# EasyEDA Pro project OctoSlime_Haptics_Module.eprj

# Schematic Haptics
Create Date: 2022-07-25; Page Name: P1; Project Name: OctoSlime_Haptics_Module; Schematic Name: Haptics; Update Date: 2022-08-20; Drawed: KeonMan; Part Number: EmbeddedAT_Hap01; Reviewed: KeonMan; Version: 1.0
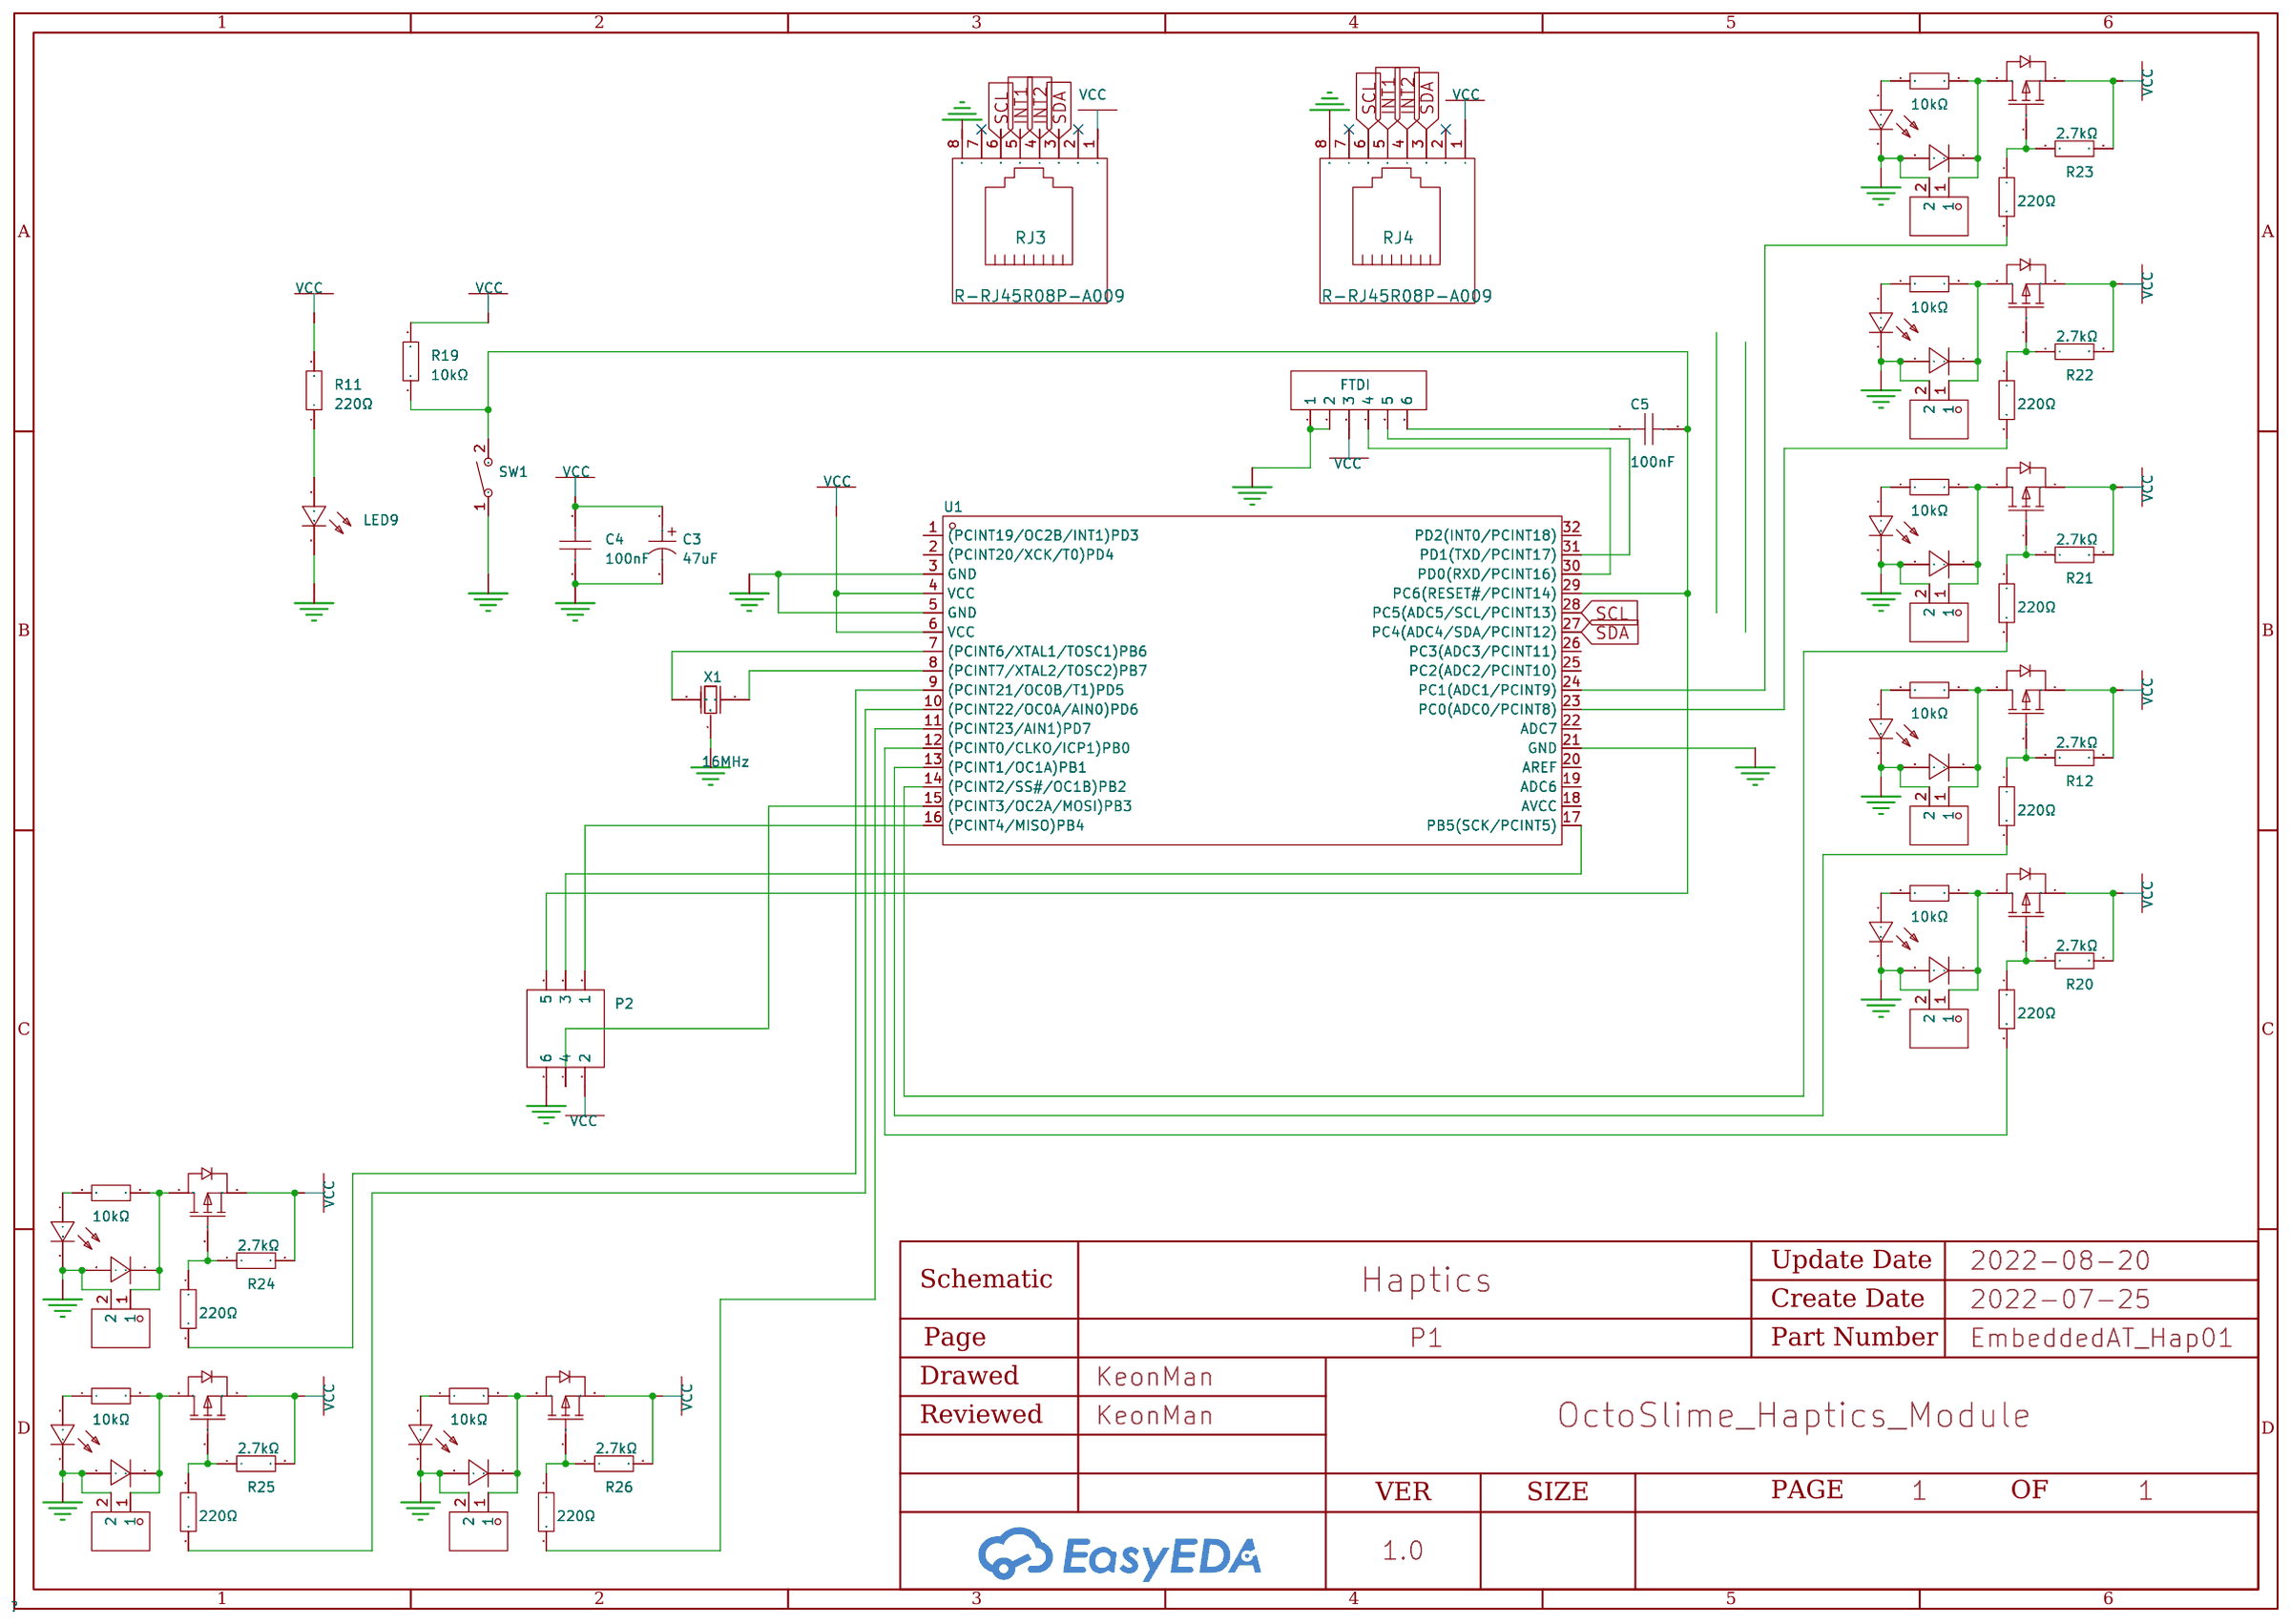
[diagram p0: schematic sheet]

## Parts
C3  47uF  [CAP-SMD_L7.3-W4.3-FD]
C4  100nF  [C0603]
C5  100nF  [C0603]
CN1  -  [CONN-TH_2P-P2.50_HX25003-2WAP]
CN2  -  [CONN-TH_2P-P2.50_HX25003-2WAP]
CN3  -  [CONN-TH_2P-P2.50_HX25003-2WAP]
CN4  -  [CONN-TH_2P-P2.50_HX25003-2WAP]
CN5  -  [CONN-TH_2P-P2.50_HX25003-2WAP]
CN6  -  [CONN-TH_2P-P2.50_HX25003-2WAP]
CN7  -  [CONN-TH_2P-P2.50_HX25003-2WAP]
CN8  -  [CONN-TH_2P-P2.50_HX25003-2WAP]
D1  -  [DO-214AC_L4.3-W2.7-LS5.3-RD]
D2  -  [DO-214AC_L4.3-W2.7-LS5.3-RD]
D3  -  [DO-214AC_L4.3-W2.7-LS5.3-RD]
D4  -  [DO-214AC_L4.3-W2.7-LS5.3-RD]
D5  -  [DO-214AC_L4.3-W2.7-LS5.3-RD]
D6  -  [DO-214AC_L4.3-W2.7-LS5.3-RD]
D7  -  [DO-214AC_L4.3-W2.7-LS5.3-RD]
D8  -  [DO-214AC_L4.3-W2.7-LS5.3-RD]
FTDI  -  [HDR-TH_6P-P2.54-V-M-1]
LED1  -  [LED0603-R-RD]
LED2  -  [LED0603-R-RD]
LED3  -  [LED0603-R-RD]
LED4  -  [LED0603-R-RD]
LED5  -  [LED0603-R-RD]
LED6  -  [LED0603-R-RD]
LED7  -  [LED0603-R-RD]
LED8  -  [LED0603-R-RD]
LED9  -  [LED0603-R-RD]
P2  -  [IDC-TH_6P-P2.54_C11214]
Q1  -  [SC-70-3_L2.2-W1.2-P1.30-LS2.1-BL]
Q2  -  [SC-70-3_L2.2-W1.2-P1.30-LS2.1-BL]
Q3  -  [SC-70-3_L2.2-W1.2-P1.30-LS2.1-BL]
Q4  -  [SC-70-3_L2.2-W1.2-P1.30-LS2.1-BL]
Q5  -  [SC-70-3_L2.2-W1.2-P1.30-LS2.1-BL]
Q6  -  [SC-70-3_L2.2-W1.2-P1.30-LS2.1-BL]
Q7  -  [SC-70-3_L2.2-W1.2-P1.30-LS2.1-BL]
Q8  -  [SC-70-3_L2.2-W1.2-P1.30-LS2.1-BL]
R1  220Ω  [R1206]
R2  220Ω  [R1206]
R3  10kΩ  [R0603]
R4  220Ω  [R1206]
R5  10kΩ  [R0603]
R6  220Ω  [R1206]
R7  10kΩ  [R0603]
R8  220Ω  [R1206]
R9  10kΩ  [R0603]
R10  220Ω  [R1206]
R11  220Ω  [R1206]
R12  2.7kΩ  [R0603]
R13  10kΩ  [R0603]
R14  10kΩ  [R0603]
R15  220Ω  [R1206]
R16  10kΩ  [R0603]
R17  220Ω  [R1206]
R18  10kΩ  [R0603]
R19  10kΩ  [R0603]
R20  2.7kΩ  [R0603]
R21  2.7kΩ  [R0603]
R22  2.7kΩ  [R0603]
R23  2.7kΩ  [R0603]
R24  2.7kΩ  [R0603]
R25  2.7kΩ  [R0603]
R26  2.7kΩ  [R0603]
RJ3  R-RJ45R08P-A009  [RJ45-TH_R-RJ45R08P-A009]
RJ4  R-RJ45R08P-A009  [RJ45-TH_R-RJ45R08P-A009]
SW1  -  [SW-SMD_L4.0-W2.9-LS5.0]
U1  -  [TQFP-32_L7.0-W7.0-P0.80-LS9.0-BL]
X1  16MHz  [OSC-SMD_3P-L3.2-W1.3-P1.2-L]

## Library data of the parts
C3 = CA45-D-25V-47μF-K: 容值:47uF;精度:±10%;额定电压:25V;等效串联电阻:900mΩ@100kHz;工作温度:-55~+125;; LCSC Part Name: 47uF ±10% 25V; Supplier Part: C503929; Manufacturer: TORCH(火炬); Manufacturer Part: CA45-D-25V-47F-K; Supplier Footprint: CASE-D_7343; JLCPCB Part Class: Extended Part; Datasheet: https://atta.szlcsc.com/upload/public/pdf/source/20200527/C503929_DDEB89F05F49DCBD18C8D5A9FE4E26C7.pdf; Supplier: LCSC; Tolerance: ±10%; Rated Voltage: 25V; Equivalent Series Resistance(ESR): 900mΩ@100kHz; Operating Temperature: -55~+125
C4 C5 = CL10B104KB8NNNC: 容值:100nF;精度:±10%;额定电压:50V;温度系数:X7R;; LCSC Part Name: 100nF ±10% 50V; Supplier Part: C1591; Manufacturer: SAMSUNG(三星); Supplier Footprint: 0603; JLCPCB Part Class: Extended Part; Datasheet: https://atta.szlcsc.com/upload/public/pdf/source/20160103/1457707680512.pdf; Supplier: LCSC; Tolerance: ±10%; Voltage Rated: 50V; Temperature Coefficient: X7R
CN1-CN8 = HX25003-2WAP: 俗称： XH2.54 配套：HX25002-2Y; LCSC Part Name: 母座 弯插/弯针 2.5mm 2Pin位; Supplier Part: C442326; Manufacturer: HX(红星); Supplier Footprint: 插件,P=2.5mm; JLCPCB Part Class: Extended Part; Datasheet: https://atta.szlcsc.com/upload/public/pdf/source/20191028/C442326_951D1FF48F4BC139C99E649B2A876D28.pdf; Supplier: LCSC
D1-D8 = M7_C95872: 二极管配置:-;直流反向耐压(Vr):1kV;平均整流电流(Io):1A;正向压降(Vf):1.1V@1A;反向电流(Ir):5A@1kV;; LCSC Part Name: 1kV 1A 1.1V@1A GPP; Supplier Part: C95872; Manufacturer: MDD; Manufacturer Part: M7; Supplier Footprint: SMA(DO-214AC); JLCPCB Part Class: Basic Part; Datasheet: https://atta.szlcsc.com/upload/public/pdf/source/20170221/1487670316366.pdf; Supplier: LCSC; Reverse Voltage (Vr): 1kV; Average Rectified Current (Io): 1A; Forward Voltage (Vf@If): 1.1V@1A; Reverse Leakage Current: 5A@1kV
FTDI = 2.54-1x6P直针: 间距:2.54mm;总PIN位数:6;排数:1;插针结构:-;行距:-;安装类型:直插;圆针/方针:-;额定电流:-;额定电压:-;配合针长度:-;塑高:-;触头材质:黄铜;触头镀层:-;颜色:黑色;; LCSC Part Name: 2.54mm; Supplier Part: C37208; Manufacturer: BOOMELE(博穆精密); Supplier Footprint: 插件,P=2.54mm; JLCPCB Part Class: Extended Part; Datasheet: https://atta.szlcsc.com/upload/public/pdf/source/20151109/1457707558014.pdf; Supplier: LCSC; Pitch: 2.54mm; Number of Pins: 6; Number of Rows: 1; Mounting Type: 直插; Contact Material: 黄铜; Color: 黑色
LED1-LED9 = 19-213/R6C-AP1Q2B/3T: 发光颜色:红灯;; LCSC Part Name: Briliant Red; Supplier Part: C128051; Manufacturer: EVERLIGHT(台湾亿光); Supplier Footprint: 0603; JLCPCB Part Class: Extended Part; Datasheet: https://atta.szlcsc.com/upload/public/pdf/source/20181127/C128051_25A9A75D91D4088C5FF567B51E5BBE72.pdf; Supplier: LCSC; Emitted Color: 红灯
P2 = 2.54-2*3P简牛: 连接器类型:简牛座;间距:2.54mm;排数:2;行距:2.54mm;封装形式:直插;触头材质:黄铜;触头镀层:金;; LCSC Part Name: 2.54mm 排数:2 2*3P; Supplier Part: C11214; Manufacturer: BOOMELE(博穆精密); Supplier Footprint: 插件,P=2.54mm; JLCPCB Part Class: Extended Part; Datasheet: https://atta.szlcsc.com/upload/public/pdf/source/20140331/1457707037652.pdf; Supplier: LCSC; Connector Type: 简牛座; Pitch: 2.54mm; Number of Rows: 2; Row Spacing: 2.54mm; Holder Type: 直插; Contact Material: 黄铜; Contact Plating: 金
Q1-Q8 = CJ2101: 类型:P沟道;漏源电压(Vdss):20V;连续漏极电流(Id):1.4A;功率(Pd):290mW;导通电阻(RDS(on)@Vgs,Id):100mΩ@4.5V,1A;阈值电压(Vgs(th)@Id):700mV@250A;; LCSC Part Name: P沟道 20V 1.4A; Supplier Part: C52641; Manufacturer: CJ（江苏长电/长晶）; Supplier Footprint: SOT-323(SC-70); JLCPCB Part Class: Extended Part; Datasheet: https://atta.szlcsc.com/upload/public/pdf/source/20160713/1468379852203.pdf; Supplier: LCSC; Type: P沟道; Drain Source Voltage (Vdss): 20V; Continuous Drain Current (Id): 1.4A; Power Dissipation (Pd): 290mW; Drain Source On Resistance (RDS(on)@Vgs,Id): 100mΩ@4.5V,1A; Gate Threshold Voltage (Vgs(th)@Id): 700mV@250A
R1 R2 R4 R6 R8 R10 R11 R15 R17 = RC1206FR-07220RL: 电阻类型:厚膜电阻;阻值:220Ω;精度:±1%;功率:250mW;温度系数:±100ppm/;最大工作电压:200V;工作温度范围:-55~+155;; LCSC Part Name: 220Ω ±1%; Supplier Part: C137353; Manufacturer: YAGEO(国巨); Supplier Footprint: 1206; JLCPCB Part Class: Extended Part; Datasheet: https://atta.szlcsc.com/upload/public/pdf/source/20171106/C137353_15099603814611093519.pdf; Supplier: LCSC; Type: 厚膜电阻; Tolerance: ±1%; Power(Watts): 250mW; Temperature Coefficient: ±100ppm/; Overload Voltage (Max): 200V; Operating Temperature Range: -55~+155
R3 R5 R7 R9 R13 R14 R16 R18 R19 = AR03BTDX1002: 电阻类型:薄膜电阻;阻值:10kΩ;精度:±0.1%;功率:100mW;温度系数:±50ppm/;最大工作电压:50V;工作温度范围:-55~+155;; LCSC Part Name: 10kΩ ±0.1% 100mW; Supplier Part: C319938; Manufacturer: 光颉(Viking); Supplier Footprint: 0603; JLCPCB Part Class: Extended Part; Datasheet: https://atta.szlcsc.com/upload/public/pdf/source/20181130/C319938_77E38B8D4CD7481495A6FE69BA8AB438.pdf; Supplier: LCSC; Type: 薄膜电阻; Tolerance: ±0.1%; Power(Watts): 100mW; Temperature Coefficient: ±50ppm/; Overload Voltage (Max): 50V; Operating Temperature Range: -55~+155
R12 R20-R26 = 0603WAF2701T5E: 电阻类型:厚膜电阻;阻值:2.7kΩ;精度:±1%;功率:100mW;温度系数:±100ppm/;最大工作电压:75V;工作温度范围:-55~+155;; LCSC Part Name: 2.7kΩ ±1% 100mW; Supplier Part: C13167; Manufacturer: UNI-ROYAL(厚声); Supplier Footprint: 0603; JLCPCB Part Class: Basic Part; Datasheet: https://atta.szlcsc.com/upload/public/pdf/source/20200306/C422600_1E6D84923E4A46A82E41ADD87F860B5C.pdf; Supplier: LCSC; Type: 厚膜电阻; Tolerance: ±1%; Power(Watts): 100mW; Temperature Coefficient: ±100ppm/; Overload Voltage (Max): 75V; Operating Temperature Range: -55~+155
RJ3 RJ4 = R-RJ45R08P-A009: link: https://atta.szlcsc.com/upload/public/pdf/source/20211021/D54662BD8381AD1D1DF920996089EE18.pdf; Supplier: LCSC; Supplier Part: C2902700; Manufacturer: Ckmtw(灿科盟); JLCPCB Part Class: Extended Part
SW1 = TS342A2P-WZ: LCSC Part Name: 轻触开关 3*4*2 两脚小龟不带柱 250gf 黑色塑胶按钮; Supplier Part: C557591; Manufacturer: SHOU HAN(首韩); Supplier Footprint: SMD; JLCPCB Part Class: Extended Part; Datasheet: https://atta.szlcsc.com/upload/public/pdf/source/20200519/C557591_B3A5A21584733303F06306F18577DA8B.pdf; Supplier: LCSC
U1 = ATMEGA328P-AU: CPU内核:AVR;主频（MAX):20MHz;工作电压:1.8V ~ 5.5V;; Supplier Part: C14877; Manufacturer: MICROCHIP(美国微芯); Supplier Footprint: TQFP-32_7x7x08P; JLCPCB Part Class: Basic Part; Datasheet: https://atta.szlcsc.com/upload/public/pdf/source/20140621/1457707095197.pdf; Supplier: LCSC; Core Processor: AVR; Speed: 20MHz; Voltage - Supply (Vcc/Vdd): 1.8V ~ 5.5V; Program Memory Size: 32KB (16W); RAM Size: 2KB; EEPROM Size: 1KB; Number of I/O: 23; A/D: 8x10bit; PWM: 6
X1 = CSTNE16M0V530000R0: 频率:16MHz;频率容差:±0.5%;内藏负载电容:15pF;谐振阻抗:40Ω;; LCSC Part Name: 16MHz ±0.5% 15pF; Supplier Part: C341521; Manufacturer: muRata(村田); Supplier Footprint: SMD3213-3P; JLCPCB Part Class: Extended Part; Datasheet: https://atta.szlcsc.com/upload/public/pdf/source/20181211/C341521_3DF77211002AAEDE8E1FD920A512C1E4.pdf; Supplier: LCSC; Frequency Stability: ±0.3%; Frequency Tolerance: ±0.5%; Built-in Load Capacitance: 15pF; Resonant Impedance: 40Ω; Operating Temperature: -40~+85

## Nets
GND: C3.2 C4.1 CN1.2 CN2.2 CN3.2 CN4.2 CN5.2 CN6.2 CN7.2 CN8.2 D1.2(A) D2.2(A) D3.2(A) D4.2(A) D5.2(A) D6.2(A) D7.2(A) D8.2(A) FTDI.1 FTDI.2 LED1.2(C) LED2.2(C) LED3.2(C) LED4.2(C) LED5.2(C) LED6.2(C) LED7.2(C) LED8.2(C) LED9.2(C) P2.6 RJ3.8 RJ4.8 SW1.1 U1.3(GND) U1.5(GND) U1.21(GND) X1.2(GND)
VCC: C3.1 C4.2 FTDI.3 P2.2 Q1.2(S) Q2.2(S) Q3.2(S) Q4.2(S) Q5.2(S) Q6.2(S) Q7.2(S) Q8.2(S) R11.2 R12.2 R19.2 R20.2 R21.2 R22.2 R23.2 R24.2 R25.2 R26.2 RJ3.1 RJ4.1 U1.4(VCC) U1.6(VCC)
INT1: RJ3.5 RJ4.5
INT2: RJ3.4 RJ4.4
SCL: RJ3.6 RJ4.6 U1.28(PC5(ADC5/SCL/PCINT13))
SDA: RJ3.3 RJ4.3 U1.27(PC4(ADC4/SDA/PCINT12))
$1N5111: U1.7((PCINT6/XTAL1/TOSC1)PB6) X1.3(OSC2)
$1N5116: U1.8((PCINT7/XTAL2/TOSC2)PB7) X1.1(OSC1)
$1N6625: R17.2 U1.9((PCINT21/OC0B/T1)PD5)
$1N10865: P2.1 U1.16((PCINT4/MISO)PB4)
$1N10972: P2.3 U1.17(PB5(SCK/PCINT5))
$1N11114: C5.2 P2.5 R19.1 SW1.2 U1.29(PC6(RESET#/PCINT14))
$1N11268: P2.4 U1.15((PCINT3/OC2A/MOSI)PB3)
$1N21722: LED9.1(A) R11.1
$1N25142: R1.2 U1.24(PC1(ADC1/PCINT9))
$1N25143: R2.2 U1.23(PC0(ADC0/PCINT8))
$1N25144: R4.2 U1.14((PCINT2/SS#/OC1B)PB2)
$1N25145: R6.2 U1.13((PCINT1/OC1A)PB1)
$1N25146: R8.2 U1.12((PCINT0/CLKO/ICP1)PB0)
$1N25147: R10.2 U1.11((PCINT23/AIN1)PD7)
$1N25149: R15.2 U1.10((PCINT22/OC0A/AIN0)PD6)
$1N42067: Q5.1(G) R8.1 R20.1
$1N47436: C5.1 FTDI.6
$1N47489: FTDI.5 U1.31(PD1(TXD/PCINT17))
$1N47548: FTDI.4 U1.30(PD0(RXD/PCINT16))
$1N67957: LED5.1(A) R9.1
$1N70049: CN5.1 D4.1(K) Q5.3(D) R9.2
$1N76307: CN4.1 D3.1(K) Q4.3(D) R7.2
$1N76308: LED4.1(A) R7.1
$1N76310: Q4.1(G) R6.1 R12.1
$1N77326: CN3.1 D2.1(K) Q3.3(D) R5.2
$1N77327: LED3.1(A) R5.1
$1N77329: Q3.1(G) R4.1 R21.1
$1N78229: CN2.1 D1.1(K) Q2.3(D) R3.2
$1N78230: LED2.1(A) R3.1
$1N78232: Q2.1(G) R2.1 R22.1
$1N79139: CN1.1 D8.1(K) Q1.3(D) R13.2
$1N79140: LED1.1(A) R13.1
$1N79142: Q1.1(G) R1.1 R23.1
$1N80056: CN8.1 D7.1(K) Q8.3(D) R18.2
$1N80057: LED8.1(A) R18.1
$1N80059: Q8.1(G) R17.1 R24.1
$1N81090: CN7.1 D6.1(K) Q7.3(D) R16.2
$1N81091: LED7.1(A) R16.1
$1N81093: Q7.1(G) R15.1 R25.1
$1N82688: CN6.1 D5.1(K) Q6.3(D) R14.2
$1N82689: LED6.1(A) R14.1
$1N82691: Q6.1(G) R10.1 R26.1

Not connected (* = marked no-connect by the designer): RJ3 2* 7*; RJ4 2* 7*; U1 1((PCINT19/OC2B/INT1)PD3) 2((PCINT20/XCK/T0)PD4) 18(AVCC) 19(ADC6) 20(AREF) 22(ADC7) 25(PC2(ADC2/PCINT10)) 26(PC3(ADC3/PCINT11)) 32(PD2(INT0/PCINT18))

# Board PCB1
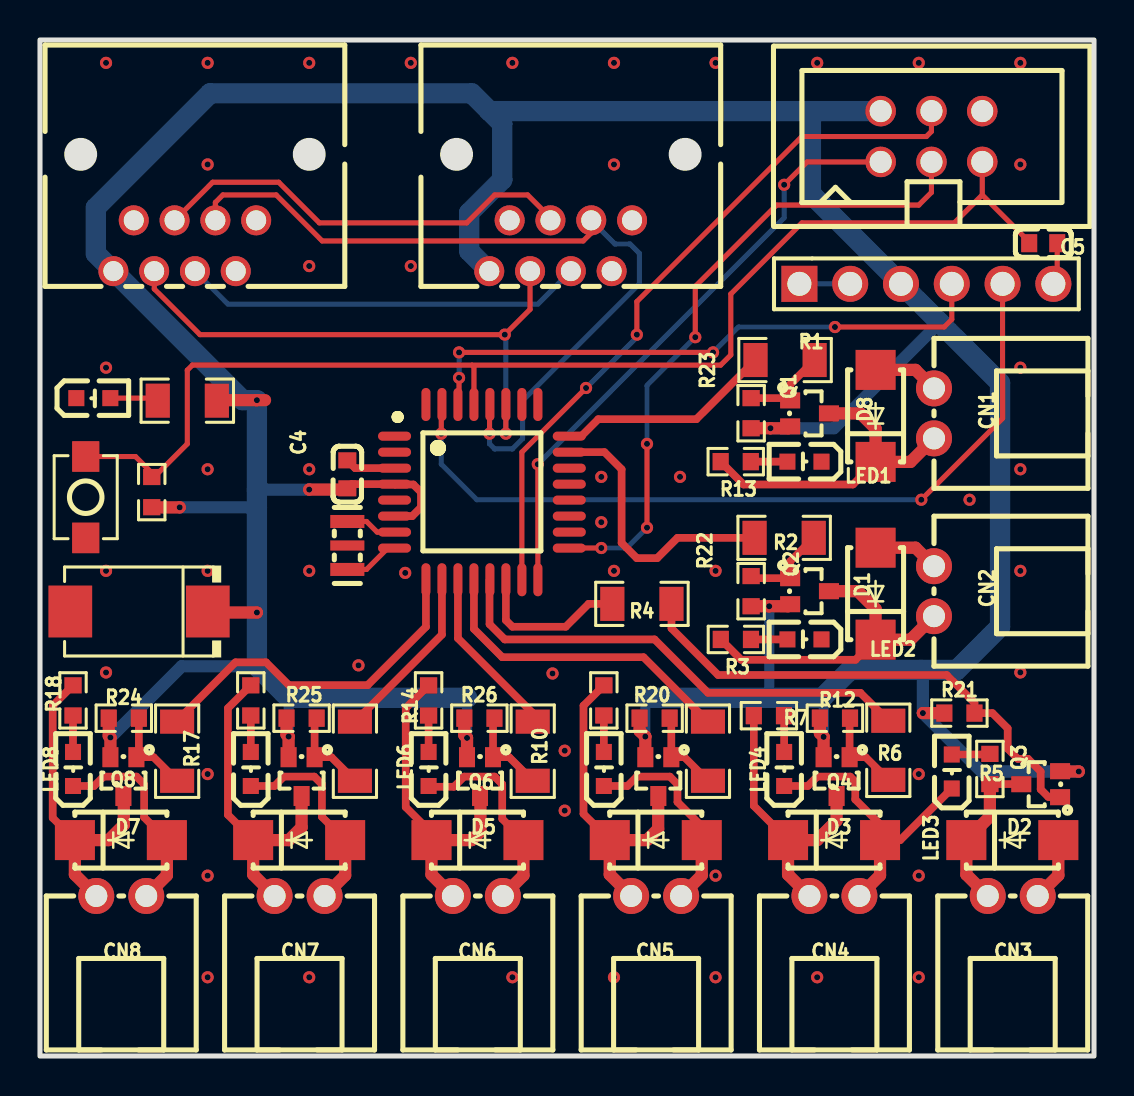
[diagram p1: board, top side]
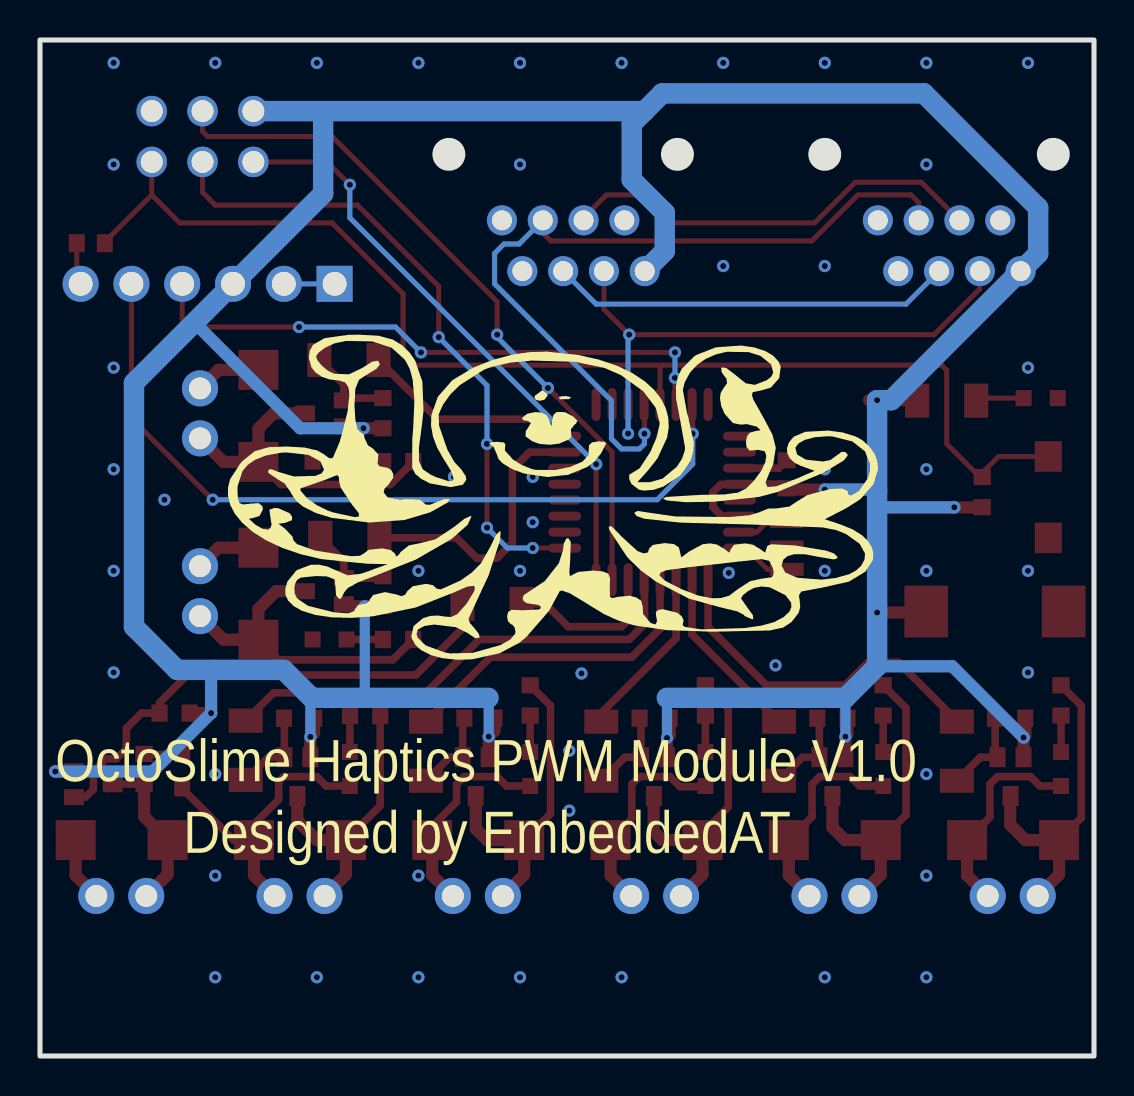
[diagram p2: board, bottom side, seen from below]

Outline 52.7 x 50.8 mm; copper layers: Top Layer, Bottom Layer. Coordinates in mm from the lower left corner of the outline.
Outline path: rectangle 0,50.8 52.7,0
Stack: Top Layer 0.035mm / Dielectric1 1.51mm FR4 er 4.5 / Bottom Layer 0.035mm

## Design rules (mm)
spacing safeClearance (default): track to track 0.152, other pairs 0.152 to 0.3
track width trackWidth (default): min 0.127, default 0.254, max 2.54
differential pair differentialPair (default): width min 0.127, default 0.254, max 2.54; gap min 0.152, default 0.152
via viaSize (default): diameter min 0.5, default 0.61, max 10; hole min 0.3, default 0.305, max 6

## Placement (name value [footprint] x y rotation side)
C3  47uF  [CAP-SMD_L7.3-W4.3-FD]  4.95 22.23 180 top
C4  100nF  [C0603]  15.37 29.08 270 top
C5  100nF  [C0603]  50.17 40.64 180 top
CN1  -  [CONN-TH_2P-P2.50_HX25003-2WAP]  44.7 32.13 90 top
CN2  -  [CONN-TH_2P-P2.50_HX25003-2WAP]  44.7 23.24 90 top
CN3  -  [CONN-TH_2P-P2.50_HX25003-2WAP]  48.64 8 0 top
CN4  -  [CONN-TH_2P-P2.50_HX25003-2WAP]  39.73 8 0 top
CN5  -  [CONN-TH_2P-P2.50_HX25003-2WAP]  30.81 8 0 top
CN6  -  [CONN-TH_2P-P2.50_HX25003-2WAP]  21.89 8 0 top
CN7  -  [CONN-TH_2P-P2.50_HX25003-2WAP]  12.98 8 0 top
CN8  -  [CONN-TH_2P-P2.50_HX25003-2WAP]  4.06 8 0 top
D1  -  [DO-214AC_L4.3-W2.7-LS5.3-RD]  41.78 23.11 90 top
D2  -  [DO-214AC_L4.3-W2.7-LS5.3-RD]  48.62 10.8 0 top
D3  -  [DO-214AC_L4.3-W2.7-LS5.3-RD]  39.71 10.8 0 top
D4  -  [DO-214AC_L4.3-W2.7-LS5.3-RD]  30.79 10.8 0 top
D5  -  [DO-214AC_L4.3-W2.7-LS5.3-RD]  21.87 10.8 0 top
D6  -  [DO-214AC_L4.3-W2.7-LS5.3-RD]  12.96 10.8 0 top
D7  -  [DO-214AC_L4.3-W2.7-LS5.3-RD]  4.04 10.8 0 top
D8  -  [DO-214AC_L4.3-W2.7-LS5.3-RD]  41.78 32 90 top
FTDI  -  [HDR-TH_6P-P2.54-V-M-1]  44.32 38.61 0 top
LED1  -  [LED0603-R-RD]  38.23 29.72 180 top
LED2  -  [LED0603-R-RD]  38.23 20.83 180 top
LED3  -  [LED0603-R-RD]  45.59 14.22 90 top
LED4  -  [LED0603-R-RD]  37.21 14.35 90 top
LED5  -  [LED0603-R-RD]  28.19 14.35 90 top
LED6  -  [LED0603-R-RD]  19.43 14.35 90 top
LED7  -  [LED0603-R-RD]  10.54 14.35 90 top
LED8  -  [LED0603-R-RD]  1.65 14.35 90 top
LED9  -  [LED0603-R-RD]  2.67 32.89 0 top
P2  -  [IDC-TH_6P-P2.54_C11214]  44.58 45.97 0 top
Q1  -  [SC-70-3_L2.2-W1.2-P1.30-LS2.1-BL]  38.48 32.13 270 top
Q2  -  [SC-70-3_L2.2-W1.2-P1.30-LS2.1-BL]  38.48 23.24 270 top
Q3  -  [SC-70-3_L2.2-W1.2-P1.30-LS2.1-BL]  50.04 13.59 90 top
Q4  -  [SC-70-3_L2.2-W1.2-P1.30-LS2.1-BL]  39.83 13.97 180 top
Q5  -  [SC-70-3_L2.2-W1.2-P1.30-LS2.1-BL]  30.92 13.97 180 top
Q6  -  [SC-70-3_L2.2-W1.2-P1.30-LS2.1-BL]  22 13.97 180 top
Q7  -  [SC-70-3_L2.2-W1.2-P1.30-LS2.1-BL]  13.08 13.97 180 top
Q8  -  [SC-70-3_L2.2-W1.2-P1.30-LS2.1-BL]  4.17 13.97 180 top
R1  220Ω  [R1206]  37.26 34.8 180 top
R2  220Ω  [R1206]  37.21 25.91 180 top
R3  10kΩ  [R0603]  34.8 20.83 180 top
R4  220Ω  [R1206]  30.1 22.61 180 top
R5  10kΩ  [R0603]  47.5 14.35 270 top
R6  220Ω  [R1206]  42.42 15.29 90 top
R7  10kΩ  [R0603]  36.45 17.02 180 top
R8  220Ω  [R1206]  33.4 15.24 90 top
R9  10kΩ  [R0603]  28.19 17.78 90 top
R10  220Ω  [R1206]  24.64 15.24 90 top
R11  220Ω  [R1206]  7.37 32.77 0 top
R12  2.7kΩ  [R0603]  39.75 16.89 180 top
R13  10kΩ  [R0603]  34.79 29.72 180 top
R14  10kΩ  [R0603]  19.43 17.78 90 top
R15  220Ω  [R1206]  15.75 15.24 90 top
R16  10kΩ  [R0603]  10.54 17.78 90 top
R17  220Ω  [R1206]  6.86 15.24 90 top
R18  10kΩ  [R0603]  1.65 17.78 90 top
R19  10kΩ  [R0603]  5.59 28.19 270 top
R20  2.7kΩ  [R0603]  30.73 16.89 180 top
R21  2.7kΩ  [R0603]  45.97 17.14 180 top
R22  2.7kΩ  [R0603]  35.56 23.24 270 top
R23  2.7kΩ  [R0603]  35.56 32.14 270 top
R24  2.7kΩ  [R0603]  4.19 16.89 180 top
R25  2.7kΩ  [R0603]  13.08 16.89 180 top
R26  2.7kΩ  [R0603]  21.97 16.89 180 top
RJ3  R-RJ45R08P-A009  [RJ45-TH_R-RJ45R08P-A009]  26.04 40.51 180 top
RJ4  R-RJ45R08P-A009  [RJ45-TH_R-RJ45R08P-A009]  7.24 40.51 180 top
SW1  -  [SW-SMD_L4.0-W2.9-LS5.0]  2.29 27.94 90 top
U1  -  [TQFP-32_L7.0-W7.0-P0.80-LS9.0-BL]  22.1 28.19 270 top
X1  16MHz  [OSC-SMD_3P-L3.2-W1.3-P1.2-L]  15.37 25.53 90 top

## Footprints (pads in the part's own frame, mm; a bottom-side part is the same pattern mirrored in y, then rotated)
C0603
  rect 0.8x0.899 smd: 1(-0.701,0) 2(0.701,0)
CAP-SMD_L7.3-W4.3-FD
  rect 2.184x2.591 smd: 1(-3.437,0) 2(3.437,0)
CONN-TH_2P-P2.50_HX25003-2WAP
  round 1.801 hole 1.1: 1(-1.25,0) 2(1.25,0)
DO-214AC_L4.3-W2.7-LS5.3-RD
  rect 1.999x1.999 smd: 1(-2.299,0) 2(2.301,0)
HDR-TH_6P-P2.54-V-M-1
  rect 1.801x1.801 hole 1.199: 1(-6.35,0)
  round 1.801 hole 1.199: 2(-3.81,0) 3(-1.27,0) 4(1.27,0) 5(3.81,0) 6(6.35,0)
IDC-TH_6P-P2.54_C11214
  round 1.524 hole 1.1: 1(-2.54,-1.27) 2(-2.54,1.27) 3(0,-1.27) 4(0,1.27) 5(2.54,-1.27) 6(2.54,1.27)
LED0603-R-RD
  rect 0.8x0.8 smd: 1(0.851,0) 2(-0.851,0)
OSC-SMD_3P-L3.2-W1.3-P1.2-L
  rect 0.65x1.7 smd: 1(-1.199,0) 3(1.199,0)
  rect 0.5x1.7 smd: 2(0,0)
R0603
  rect 0.806x0.864 smd: 1(-0.753,0) 2(0.753,0)
R1206
  rect 1.206x1.702 smd: 1(-1.478,0) 2(1.478,0)
RJ45-TH_R-RJ45R08P-A009
  round 1.5 hole 1: 1(3.57,1.27) 2(2.55,-1.27) 3(1.53,1.27) 4(0.51,-1.27) 5(-0.51,1.27) 6(-1.53,-1.27) 7(-2.55,1.27) 8(-3.57,-1.27)
SC-70-3_L2.2-W1.2-P1.30-LS2.1-BL
  rect 0.8x1.001 smd: 1(-0.65,-0.971) 2(0.65,-0.971) 3(0,0.971)
SW-SMD_L4.0-W2.9-LS5.0
  rect 1.529x1.359 smd: 1(-2.034,0) 2(2.034,0)
TQFP-32_L7.0-W7.0-P0.80-LS9.0-BL
  oval 0.45x1.651 smd: 1(-2.799,-4.369) 2(-1.999,-4.369) 3(-1.199,-4.369) 4(-0.399,-4.369) 5(0.399,-4.369) 6(1.199,-4.369) 7(1.999,-4.369) 8(2.799,-4.369) 17(2.799,4.369) 18(1.999,4.369) 19(1.199,4.369) 20(0.399,4.369) 21(-0.399,4.369) 22(-1.199,4.369) 23(-1.999,4.369) 24(-2.799,4.369)
  oval 1.651x0.45 smd: 9(4.381,-2.799) 10(4.381,-1.999) 11(4.381,-1.199) 12(4.381,-0.399) 13(4.381,0.399) 14(4.381,1.199) 15(4.381,1.999) 16(4.381,2.799) 25(-4.381,2.799) 26(-4.381,1.999) 27(-4.381,1.199) 28(-4.381,0.399) 29(-4.381,-0.399) 30(-4.381,-1.199) 31(-4.381,-1.999) 32(-4.381,-2.799)

## Nets
As in the schematic.

Pads without a net: RJ3 2 7; RJ4 2 7; U1 1 2 18 19 20 22 25 26 32

## Via types
v1: diameter 0.61, hole 0.305, Top Layer to Bottom Layer, 80 vias

## Routing (per net, layer and track width the routed paths; a pad name or vN(x,y) marks a point on that pad's centre or on a via; arc(x,y) is an arc through that point)
GND: length 71.9
  Top Layer w0.381: LED7.2 11.72,13.5 12.19,13.97 13.72,13.97 14.1,13.59 14.1,11.96 D6.2 ; D5.2 23.11,11.86 23.11,13.59 22.73,13.97 21.21,13.97 20.7,13.46 19.47,13.46 LED6.2 ; 15.37,29.78 15.76,29.39 U1.3 ; LED3.2 43.02,10.8 D3.2 42.01,11.59 40.77,12.83 40.77,13.72 40.51,13.97 38.86,13.97 38.39,13.5 LED4.2 ; D4.2 33.09,11.49 31.88,12.7 31.88,13.59 31.5,13.97 29.85,13.97 29.38,13.5 LED5.2 ; D7.2 5.21,11.93 5.21,13.59 4.83,13.97 3.18,13.97 2.7,13.5 LED8.2
  Top Layer w0.61: D6.2 15.26,9.03 CN7.2 ; CN6.2 24.18,9.03 D5.2 ; CN2.2 43.78,25.42 D1.2 ; D2.2 50.92,9.03 CN3.2 ; D4.2 33.09,9.03 32.06,8 ; D3.2 42.01,9.03 CN4.2 ; CN8.2 6.34,9.03 D7.2 ; CN1.2 43.78,34.31 D8.2
  Bottom Layer w0.254: FTDI.2 FTDI.1
  vias: v1(3.3,49.66) v1(3.3,34.42) v1(3.3,24.26) v1(3.3,19.18) v1(8.38,49.66) v1(8.38,44.58) v1(8.38,29.34) v1(8.38,24.26) v1(8.38,14.1) v1(8.38,9.02) v1(8.38,3.94) v1(13.46,49.66) v1(13.46,39.5) v1(13.46,29.34) v1(13.46,24.26) v1(13.46,3.94) v1(15.93,19.53) v1(18.26,24.16) v1(18.54,49.66) v1(18.54,39.5) v1(23.62,49.66) v1(23.62,3.94) v1(25.63,19.13) v1(26.24,15.27) v1(26.24,12.27) v1(28.07,28.96) v1(28.07,26.69) v1(28.7,49.66) v1(28.7,44.58) v1(28.7,24.26) v1(28.7,3.94) v1(32,28.96) v1(33.78,49.66) v1(33.78,24.26) v1(33.78,9.02) v1(33.78,3.94) v1(38.86,49.66) v1(38.86,3.94) v1(43.94,49.66) v1(43.94,14.1) v1(43.94,9.02) v1(43.94,3.94) v1(46.48,27.81) v1(49.02,49.66) v1(49.02,44.58) v1(49.02,34.42) v1(49.02,29.34) v1(49.02,24.26) v1(49.02,19.18)
VCC: length 218.2
  Top Layer w0.381: U1.6 18.61,27 19.05,27.43 19.05,28.19 18.67,28.58 17.75,28.58 U1.4 15.58,28.59 C4.2
  Top Layer w0.61: R12.2 39,16.14 v1(39.18,15.96) Q4.2 ; C4.2 15.31,28.32 v1(13.46,28.32) ; Q2.2 37.41,22.49 v1(36.46,22.49) R22.2 ; R26.2 21.22,16.04 v1(21.35,15.9) Q6.2 ; Q5.2 v1(30.27,15.97) 29.98,16.26 R20.2 ; Q8.2 v1(3.52,15.92) 3.44,16.01 R24.2 ; R19.2 5.6,27.43 v1(6.98,27.43) ; R21.2 v1(44.15,17.14) ; R25.2 12.33,16.08 v1(12.43,15.97) Q7.2 ; 35.56,31.39 v1(36.53,31.39) 37.42,31.39 Q1.2 ; C3.1 8.44,22.17 v1(10.85,22.17) ; v1(51.94,14.22) 51.02,14.22 Q3.2 ; R11.2 8.87,32.79 v1(10.85,32.79) 11.25,32.79
  Bottom Layer w0.508: 39.12,17.91 39.18,17.84 v1(39.18,15.96) ; v1(30.27,15.97) 30.27,17.9 30.28,17.91 ; 21.36,17.91 21.35,17.9 v1(21.35,15.9) ; v1(12.43,15.97) 12.43,17.9 ; v1(36.46,22.49) 36.46,17.94 36.49,17.91
  Bottom Layer w0.61: v1(51.94,14.22) 47.07,14.22 v1(44.15,17.14) 44.15,19.2 44.04,19.3 ; 44.98,36.68 39.7,31.39 v1(36.53,31.39) ; v1(3.52,15.92) 7.09,19.49 10.85,19.49 ; v1(13.46,28.32) 10.88,28.32 10.85,28.29 ; v1(6.98,27.43) 10.84,27.43 10.85,27.44
  Bottom Layer w1.016: 38.55,47.24 P2.2 ; 38.55,47.24 22.48,47.24 ; 38.55,47.24 38.55,43.11 FTDI.3 48.01,33.66 48.01,21.46 45.85,19.3 40.51,19.3 39.12,17.91 30.28,17.91 ; 22.48,47.24 23.11,46.61 23.11,43.81 21.46,42.16 21.46,40.25 RJ3.1 ; 22.48,47.24 21.59,48.13 8.51,48.13 2.79,42.42 2.79,40.12 RJ4.1 3.68,39.24 10.13,32.79 v1(10.85,32.79) v1(10.85,22.17) 10.85,19.49 12.42,17.91 21.36,17.91
INT1: length 20.2
  Bottom Layer w0.254: RJ3.5 24.89,37.59 9.4,37.59 RJ4.5
INT2: length 21.6
  Top Layer w0.254: RJ4.4 8.63,43.69 11.94,43.69 13.97,41.66 21.34,41.66 22.73,43.05 24.38,43.05 25.52,41.91 RJ3.4
SCL: length 40.3
  Top Layer w0.254: RJ3.6 27.57,41.15 27.16,40.75 14.11,40.75 11.81,43.05 9.14,43.05 8.77,42.68 RJ4.6 ; U1.28 22.48,32.56 v1(22.48,31.11)
  Bottom Layer w0.254: v1(22.48,31.11) 22.48,30.61 22.73,30.35 23.62,30.35 24.13,30.86 24.13,32.77 29.97,38.61 29.97,40.13 29.5,40.6 28.75,40.6 RJ3.6
SDA: length 29.5
  Top Layer w0.254: RJ4.3 5.72,39.24 5.72,38.35 8,36.07 v1(23.24,36.07) 24.51,37.33 RJ3.3 ; v1(23.3,31.12) U1.27
  Bottom Layer w0.254: v1(23.3,31.12) 23.3,36.01 v1(23.24,36.07)
$1N5111: length 2.6
  Top Layer w0.254: U1.7 16.86,26.2 16.33,26.73 X1.3
$1N5116: length 2.8
  Top Layer w0.254: X1.1 16.33,24.33 17.39,25.39 U1.8
$1N6625: length 17.7
  Top Layer w0.381: R17.2 6.86,16.76 9.78,19.69 11.3,19.69 12.45,18.54 16.38,18.54 19.3,21.46 U1.9
$1N10865: length 30.2
  Top Layer w0.254: v1(42.04,44.7) 38.35,44.7 v1(37.21,43.56) ; U1.16 24.9,29.59 v1(24.89,29.59)
  Bottom Layer w0.254: v1(37.21,43.56) 37.21,41.91 v1(24.89,29.59)
$1N10972: length 32.7
  Top Layer w0.254: v1(28.07,25.4) 26.47,25.4 U1.17 ; v1(32.77,35.94) 32.77,38.48 36.83,42.55 43.94,42.55 44.58,43.18 P2.3 ; v1(30.35,26.42) v1(30.35,30.61)
  Bottom Layer w0.254: v1(28.07,25.4) 29.34,25.4 v1(30.35,26.42) ; v1(30.35,30.61) 30.35,33.53 v1(32.77,35.94)
$1N11114: length 62
  Top Layer w0.254: SW1.2 4.77,29.97 5.75,28.99 7.37,30.61 7.37,34.29 7.62,34.54 21.56,34.54 ; 47.12,43.05 45.72,41.66 38.1,41.66 34.54,38.1 34.54,35.05 34.04,34.54 21.61,34.54 21.7,34.46 U1.29 ; 47.12,43.05 P2.5 ; 47.12,43.05 49.46,40.71 C5.2
$1N11268: length 35.6
  Top Layer w0.254: P2.4 44.58,46.23 44.32,45.97 38.1,45.97 29.85,37.72 v1(29.85,36.07) ; v1(27.3,33.4) 24.1,30.19 U1.15
  Bottom Layer w0.254: v1(29.85,36.07) 29.85,35.94 v1(27.3,33.4)
$1N21722: length 2.4
  Top Layer w0.254: R11.1 5.76,32.89 LED9.1
$1N25142: length 10.9
  Top Layer w0.381: 35.78,34.8 32.82,31.84 27.91,31.84 27.07,30.99 U1.24
$1N25143: length 14
  Top Layer w0.381: R2.2 31.88,25.91 30.86,24.89 29.85,24.89 29.08,25.65 29.08,29.34 28.23,30.19 U1.23
$1N25144: length 8
  Top Layer w0.381: U1.14 23.3,21.79 23.62,21.46 26.29,21.46 27.43,22.61 R4.2
$1N25145: length 24.2
  Top Layer w0.381: U1.13 22.48,23.79 22.48,21.59 23.24,20.83 30.73,20.83 33.4,18.16 41.02,18.16 R6.2
$1N25146: length 16.1
  Top Layer w0.381: R8.2 30.18,19.94 23.11,19.94 21.7,21.35 U1.12
$1N25147: length 8.6
  Top Layer w0.381: R10.2 24.64,17.14 20.9,20.88 U1.11
$1N25149: length 8.9
  Top Layer w0.381: R15.2 20.1,21.07 U1.10
$1N42067: length 4.3
  Top Layer w0.381: R8.1 32.22,14.94 Q5.1 31.57,16.81 R20.1
$1N47436: length 2.1
  Top Layer w0.254: FTDI.6 50.87,38.8 C5.1
$1N47489: length 40.2
  Top Layer w0.254: v1(44.07,27.81) 48.13,31.88 FTDI.5 ; U1.31 20.07,32.54 v1(20.07,31.11)
  Bottom Layer w0.254: v1(20.07,31.11) 20.07,29.59 21.84,27.81 v1(44.07,27.81)
$1N47548: length 29.7
  Top Layer w0.254: v1(20.95,33.91) 20.95,32.63 U1.30 ; v1(33.66,35.18) v1(20.95,35.18) ; FTDI.4 45.59,36.83 45.21,36.45 v1(39.75,36.45)
  Bottom Layer w0.254: v1(39.75,36.45) 34.92,36.45 v1(33.66,35.18) ; v1(20.95,33.91) v1(20.95,35.18)
$1N67957: length 1.8
  Top Layer w0.381: LED5.1 R9.1
$1N70049: length 16.2
  Top Layer w0.381: R9.2 27.18,17.52 27.18,12.11 D4.1
  Top Layer w0.61: CN5.1 28.49,9.07 D4.1 30.35,10.8 30.91,11.35 30.91,12.99 Q5.3
$1N76307: length 14.2
  Top Layer w0.381: D3.1 35.69,12.51 R7.2
  Top Layer w0.61: Q4.3 39.83,11.77 38.86,10.8 D3.1 37.41,9.07 38.48,8
$1N76308: length 1.8
  Top Layer w0.381: R7.1 37.21,17.01 LED4.1
$1N76310: length 4.4
  Top Layer w0.381: R12.1 40.48,16.87 Q4.1 41.29,14.94 R6.1
$1N77326: length 8.1
  Top Layer w0.381: Q3.3 49.06,13.6 R5.2
  Top Layer w0.61: CN3.1 46.32,9.07 D2.1 47.5,11.97 R5.2
$1N77327: length 1.9
  Top Layer w0.381: LED3.1 47.47,15.08 R5.1
$1N77329: length 25.6
  Top Layer w0.381: R4.1 31.58,21.38 33.91,19.05 45.34,19.05 46.73,17.66 R21.1 47.63,17.14 48.39,16.38 48.39,15.37 48.89,14.86 49.4,14.86 50.04,14.22 50.04,13.34 50.42,12.95 50.99,12.95 Q3.1
$1N78229: length 16.2
  Top Layer w0.381: R3.2 35.06,19.81 40.78,19.81 D1.1
  Top Layer w0.61: CN2.1 43.53,20.82 D1.1 41.78,22.35 40.89,23.24 Q2.3
$1N78230: length 1.8
  Top Layer w0.381: LED2.1 R3.1
$1N78232: length 4.5
  Top Layer w0.381: R2.1 37.51,24.73 Q2.1 35.66,23.89 R22.1
$1N79139: length 16.4
  Top Layer w0.381: D8.1 40.65,28.58 35.18,28.58 34.04,29.72
  Top Layer w0.61: Q1.3 41.02,32.13 41.78,31.37 D8.1 43.53,29.71 CN1.1
$1N79140: length 1.8
  Top Layer w0.381: LED1.1 R13.1
$1N79142: length 4.5
  Top Layer w0.381: R1.1 37.51,33.57 Q1.1 37.4,32.89 R23.1
$1N80056: length 16.1
  Top Layer w0.381: D7.1 0.64,11.91 0.64,17.52 R18.2
  Top Layer w0.61: CN8.1 1.75,9.07 D7.1 3.43,10.8 4.19,11.56 4.19,12.98 Q8.3
$1N80057: length 1.8
  Top Layer w0.381: LED8.1 R18.1
$1N80059: length 4.5
  Top Layer w0.381: R24.1 4.94,15.06 Q8.1 5.68,14.94 R17.1
$1N81090: length 16.2
  Top Layer w0.381: R16.2 9.4,17.39 9.4,12.06 D6.1
  Top Layer w0.61: Q7.3 13.08,11.43 12.45,10.8 D6.1 10.66,9.07 CN7.1
$1N81091: length 1.8
  Top Layer w0.381: R16.1 LED7.1
$1N81093: length 4.5
  Top Layer w0.381: R15.1 14.57,14.94 Q7.1 13.73,16.79 13.83,16.89
$1N82688: length 16.4
  Top Layer w0.381: R14.2 18.29,17.39 18.29,12.45 19.58,11.16 D5.1
  Top Layer w0.61: Q6.3 22.02,12.98 22.02,11.23 21.59,10.8 D5.1 19.58,9.07 CN6.1
$1N82689: length 1.8
  Top Layer w0.381: LED6.1 R14.1
$1N82691: length 4.5
  Top Layer w0.381: R10.1 23.46,14.94 Q6.1 22.65,16.82 R26.1

## Copper pours and planes (outline as drawn; the poured copper is in the pictures)
GND on Top Layer: -12.37,63.42 66.75,63.42 66.75,-12.01 -12.37,-12.01
GND on Bottom Layer: -5.64,57.15 60.78,57.15 60.78,-6.35 -5.64,-6.35

## Text on the board
Bottom Silkscreen Layer: OctoSlime Haptics PWM Module V1.0 / Designed by EmbeddedAT
